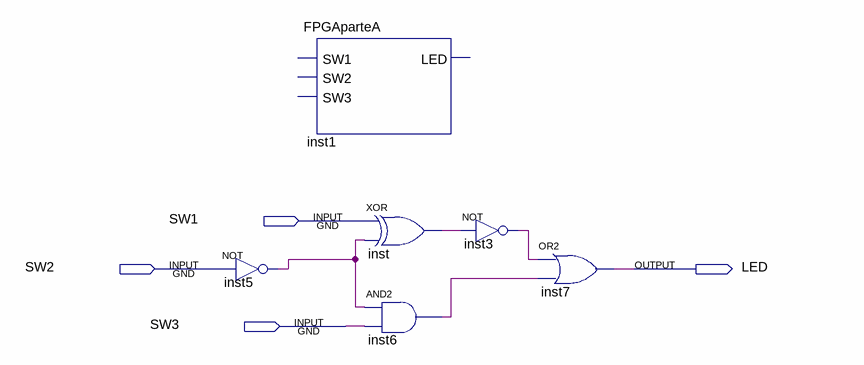
[diagram p0: schematic sheet]
// Quartus schematic esquematic_PartA.bdf as structural Verilog: 6 symbols, 4 pins
module esquematic_PartA (
  input  SW1,
  input  SW2,
  input  SW3,
  output LED
);

  wire inst3_out, inst5_out, inst6_out, inst_out;

  not inst5 (inst5_out, SW2);
  FPGAparteA inst1 ();  // open: SW1, SW2, SW3, LED
  xor inst (inst_out, SW1, inst5_out);
  and inst6 (inst6_out, inst5_out, SW3);
  not inst3 (inst3_out, inst_out);
  or inst7 (LED, inst3_out, inst6_out);
endmodule
